# EAGLE design midi_buffer (EAGLE 6.4)
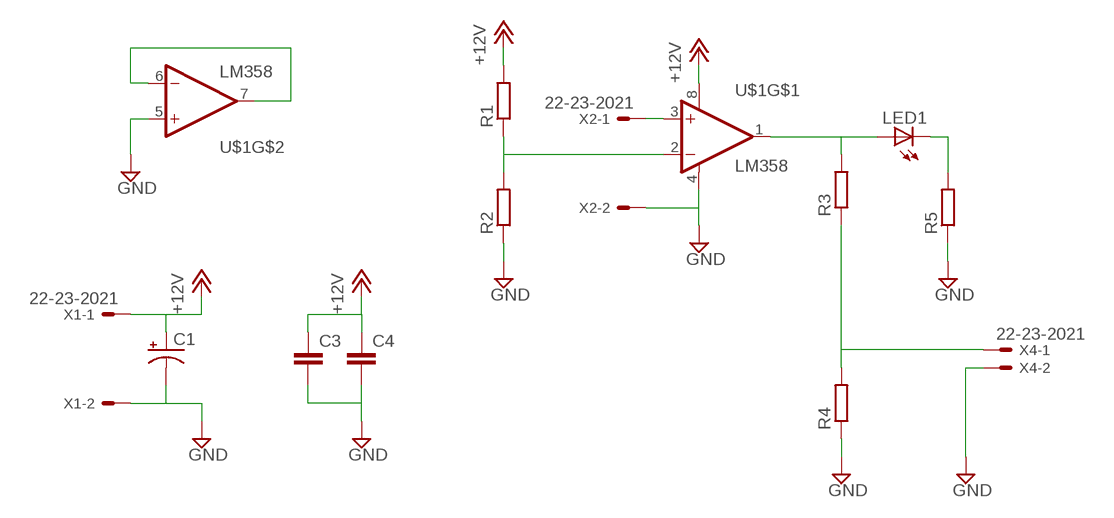
[diagram p0: schematic, sheet 1]

## Parts
C1  CPOL-USSMCE  [SMC_E]
C3  C-EUC0603K  [C0603K]
C4  C-EUC0603K  [C0603K]
LED1  LEDSML0805  [SML0805]
R1  R-EU_R0603  [R0603]
R2  R-EU_R0603  [R0603]
R3  R-EU_R0603  [R0603]
R4  R-EU_R0603  [R0603]
R5  R-EU_R0603  [R0603]
U$1  LM358  [SO08]
X1  22-23-2021  [22-23-2021]
X2  22-23-2021  [22-23-2021]
X4  22-23-2021  [22-23-2021]

## Nets
+12V: C1.+ C3.1 C4.1 R1.2 U$1.8(V+) X1.1
GND: C1.- C3.2 C4.2 R2.1 R4.1 R5.1 U$1.4(V-) U$1.5(+IN) X1.2 X2.2 X4.2
N$2: R3.1 R4.2 X4.1
N$3: LED1.C R5.2
N$4: LED1.A R3.2 U$1.1(OUT)
N$5: R1.1 R2.2 U$1.2(-IN)
N$6: U$1.3(+IN) X2.1
N$14: U$1.6(-IN) U$1.7(OUT)

## Library data of the parts
C1 = rcl:CPOL-US: POLARIZED CAPACITOR, American symbol
C3 C4 = rcl:C-EU: CAPACITOR, European symbol
LED1 = led:LED: LED OSRAM: - CHIPLED LG R971, LG N971, LY N971, LG Q971, LY Q971, LO R971, LY R971 LH N974, LH R974 LS Q976, LO Q976, LY Q976 LO Q996 - Hyper CHIPLED LW Q18S LB Q993, LB Q99A, LB R99A - SideLED LS A670, LO A670, LY A670, LG A670, LP A670 LB A673, LV A673, LT A673, LW A673 LH A674 LY A675 LS A676, LA A676, LO A676, LY A676, LW A676 LS A679, LY A679, LG A679 - Hyper Micro SIDELED® LS Y876, LA Y876, LO Y876, LY Y876 LT Y87S - SmartLED LW L88C, LW L88S LB L89C, LB L89S, LG L890 LS L89K, LO L89K, LY L89K LS L896, LA L896, LO L896, LY L896 - TOPLED LS T670, LO T670, LY T670, LG T670, LP T670 LSG T670, LSP T670, LSY T670, LOP T670, LYG T670 LG T671, LOG T671, LSG T671 LB T673, LV T673, LT T673, LW T673 LH T674 LS T676, LA T676, LO T676, LY T676, LB T676, LH T676, LSB T676, LW T676 LB T67C, LV T67C, LT T67C, LS T67K, LO T67K, LY T67K, LW E67C LS E67B, LA E67B, LO E67B, LY E67B, LB E67C, LV E67C, LT E67C LW T67C LS T679, LY T679, LG T679 LS T770, LO T770, LY T770, LG T770, LP T770 LB T773, LV T773, LT T773, LW T773 LH T774 LS E675, LA E675, LY E675, LS T675 LS T776, LA T776, LO T776, LY T776, LB T776 LHGB T686 LT T68C, LB T68C - Hyper Mini TOPLED® LB M676 - Mini TOPLED Santana® LG M470 LS M47K, LO M47K, LY M47K Source: http://www.osram.convergy.de LUXEON: - LUMILED® LXK2-PW12-R00, LXK2-PW12-S00, LXK2-PW14-U00, LXK2-PW14-V00 LXK2-PM12-R00, LXK2-PM12-S00, LXK2-PM14-U00 LXK2-PE12-Q00, LXK2-PE12-R00, LXK2-PE12-S00, LXK2-PE14-T00, LXK2-PE14-U00 LXK2-PB12-K00, LXK2-PB12-L00, LXK2-PB12-M00, LXK2-PB14-N00, LXK2-PB14-P00, LXK2-PB14-Q00 LXK2-PR12-L00, LXK2-PR12-M00, LXK2-PR14-Q00, LXK2-PR14-R00 LXK2-PD12-Q00, LXK2-PD12-R00, LXK2-PD12-S00 LXK2-PH12-R00, LXK2-PH12-S00 LXK2-PL12-P00, LXK2-PL12-Q00, LXK2-PL12-R00 Source: www.luxeon.com KINGBRIGHT: KA-3528ASYC Source: www.kingbright.com
R1-R5 = rcl:R-EU_: RESISTOR, European symbol
U$1 = synth_design:LM358
X1 X2 X4 = con-molex:22-23-2021: .100" (2.54mm) Center Header - 2 Pin; MF: MOLEX; MPN: 22-23-2021; OC_FARNELL: 1462926; OC_NEWARK: 25C3832

## Board
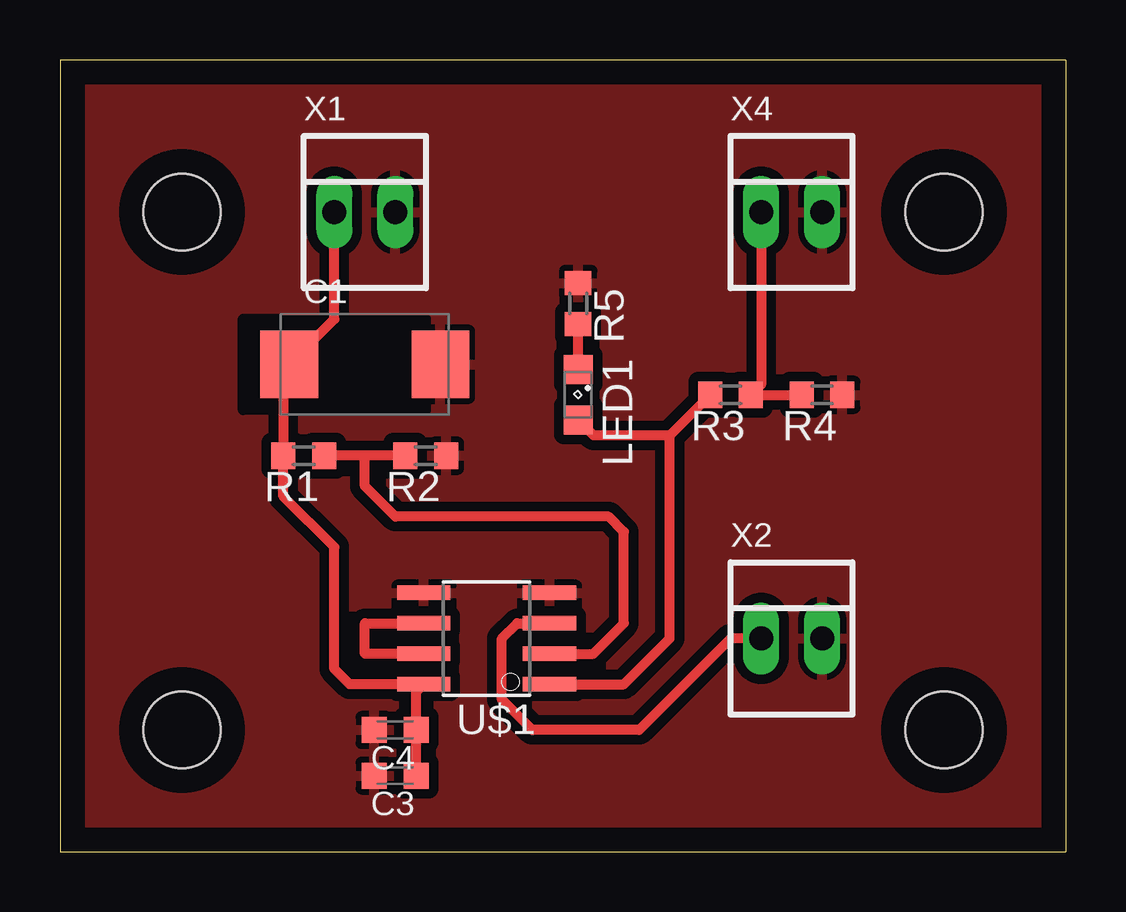
[diagram p1: board, top side]

Size 41.91 x 33.01 mm. Coordinates in mm from the lower left corner, seen from the top.
Outline: 0,0 41.91,0 41.91,33.01 0,33.01 0,0
Copper layers (1*16): Top 0.035mm / dielectric 1.5mm / Bottom 0.035mm
Design rules "default *": minimum track width 10mil, minimum drill 24mil, track to track 16mil, track to pad 16mil, pad to pad 16mil, via to via 16mil, smd to smd 16mil, copper to edge 40mil, drill to drill 8mil, minimum pad ring 10mil, minimum via ring 8mil, stop-mask expansion 4mil, vias tented up to drill 0mil, thermal gap 10mil
Holes 3.2 mm at 5.08,26.67 36.83,26.67 36.83,5.08 5.08,5.08
tRestrict: area 7.6,18.4 to 15.2,22.2

### Footprints (pad centres in the part's own frame; a part is rotated, then mirrored left to right if it is on the bottom)
SMC_E = smd 2.4 x 2.8: + -3.15,0; - 3.15,0
C0603K = smd 1.05 x 1.08: 1 -0.875,0; 2 0.875,0
SML0805 = smd 1.2 x 1.2: A 1.05,0; C -1.05,0
R0603 = smd 1 x 1.1: 1 -0.85,0; 2 0.85,0
SO08 = smd 0.61 x 2.21: 1 -1.905,-2.616; 2 -0.635,-2.616; 3 0.635,-2.616; 4 1.905,-2.616; 5 1.905,2.616; 6 0.635,2.616; 7 -0.635,2.616; 8 -1.905,2.616
22-23-2021 = drill 1 long: 1 -1.27,0; 2 1.27,0

### Placement (x,y rotation side)
C1  12.7,20.32 0 top
C3  13.97,3.17 180 top
C4  13.97,5.08 180 top
LED1  21.59,19.05 270 top
R1  10.16,16.51 180 top
R2  15.24,16.51 180 top
R3  27.94,19.05 180 top
R4  31.75,19.05 180 top
R5  21.59,22.86 270 top
U$1  17.78,8.89 90 top
X1  12.7,26.67 0 top
X2  30.48,8.89 0 top
X4  30.48,26.67 0 top

### Tracks (layer width: path | path; a pad name or v marks a point on that pad's centre or on a via)
+12V
  Top 0.406: C3.1 C4.1 14.85,6.67 U$1.8 12.06,6.99 11.43,7.62 11.43,12.7 9.31,14.82 R1.2 9.31,20.08 C1.+ 11.43,22.2 X1.1
GND
  pour Top: 0,33.02 0,0 41.91,0 41.91,33.02
N$2
  Top 0.406: R4.2 R3.1 29.21,19.47 X4.1
N$3
  Top 0.406: LED1.C R5.2
N$4
  Top 0.406: 21.59,17.78 LED1.A 22.23,17.36 25.4,17.36 | U$1.1 23.5,6.99 25.4,8.89 25.4,17.36 | 25.4,17.36 R3.2
N$5
  Top 0.406: U$1.2 22.23,8.26 23.5,9.53 23.5,13.34 22.86,13.97 13.97,13.97 12.7,15.24 12.7,16.51 | 12.7,16.51 R1.1 | R2.2 12.7,16.51
N$6
  Top 0.406: X2.1 27.94,8.89 24.13,5.08 19.68,5.08 18.41,6.35 18.41,8.89 19.05,9.53 U$1.3
N$14
  Top 0.406: U$1.7 12.7,8.26 12.7,9.53 U$1.6